# Altium project CMD3_KIT.PrjPcb
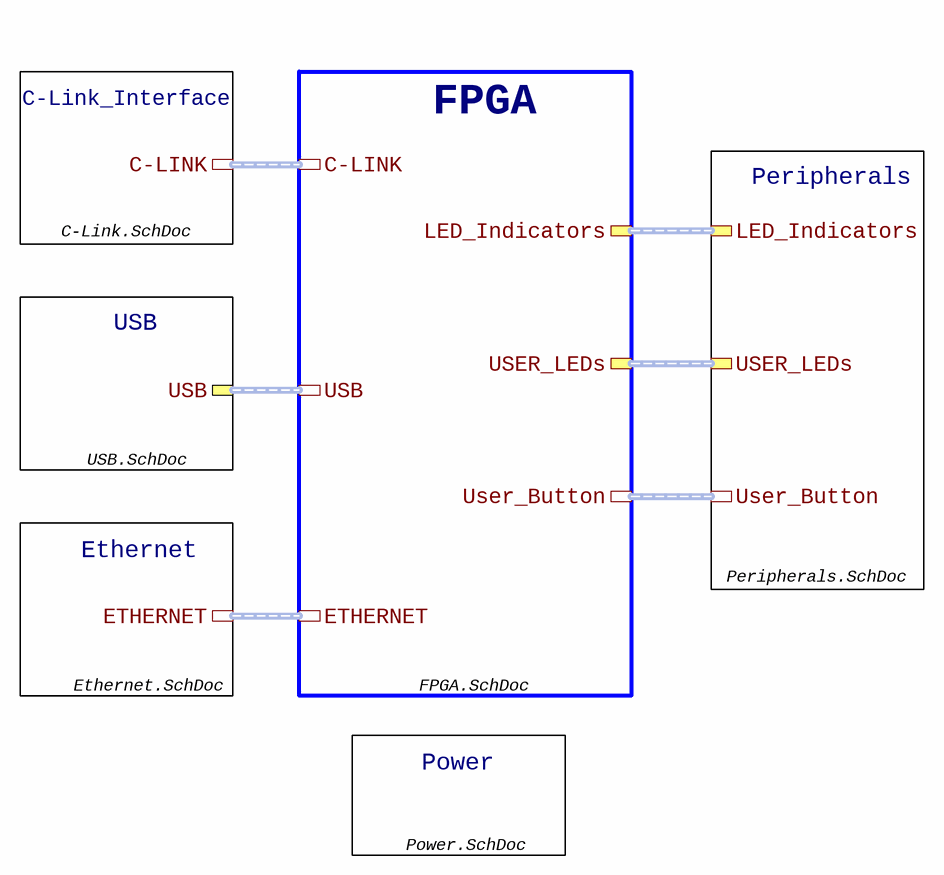
[diagram p0: Top.SchDoc]
7 sheets, 210 parts. Net scope: hierarchical (ports join the sheet entries above them; power ports are global).
Board file: CMD3_KIT.PcbDoc
Sheets:
  Top.SchDoc
    C-Link_Interface = C-Link.SchDoc
    FPGA = FPGA.SchDoc
    Ethernet = Ethernet.SchDoc
    USB = USB.SchDoc
    Power = Power.SchDoc
    Peripherals = Peripherals.SchDoc

## Sheet Top.SchDoc
size A4; Author: ALTIUM GOSTBOM2.0 KEV; SheetNumber: 1; SheetTotal: 7

### Sub-sheets
C-Link_Interface = C-Link.SchDoc: C-LINK (harness C-LINK)
Ethernet = Ethernet.SchDoc: ETHERNET (harness MII Signal Descriptions)
FPGA = FPGA.SchDoc: C-LINK (harness C-LINK), USB (harness USB), ETHERNET (harness MII Signal Descriptions), LED_Indicators (harness Indicators), USER_LEDs (harness USER_LEDs), User_Button (harness User_Button)
Peripherals = Peripherals.SchDoc: USER_LEDs (harness USER_LEDs), LED_Indicators (harness Indicators), User_Button (harness User_Button)  | NameFunctionGroup: Функциональная группа
Power = Power.SchDoc: no entries
USB = USB.SchDoc: USB (harness USB)

### Buses and harness runs
harness sheet C-Link_Interface/C-LINK = sheet FPGA/C-LINK
harness sheet Ethernet/ETHERNET = sheet FPGA/ETHERNET
harness sheet FPGA/LED_Indicators = sheet Peripherals/LED_Indicators
harness sheet FPGA/USB = sheet USB/USB
harness sheet FPGA/User_Button = sheet Peripherals/User_Button
harness sheet FPGA/USER_LEDs = sheet Peripherals/USER_LEDs

### Notes on the sheet
- Перв. примен.
- Справ. №
- Подп. дата
- Инв. № дубл.
- Взам. инв. №
- Подп. и дата
- Изм.
- Разраб.
- Лист
- № докум.
- Подп.
- Дата
- Лит.
- Масса
- Масштаб
- Пров.
- Т.контр.
- Листов
- Инв. № подл.
- Н.контр.
- Утв.
- ALTIUM GOSTBOM2.0 KEV
- Файл:
- Копировал
- Формат А3

## Sheet C-Link.SchDoc
size A4; Author: ALTIUM GOSTBOM2.0 KEV; SheetNumber: 3; SheetTotal: 7
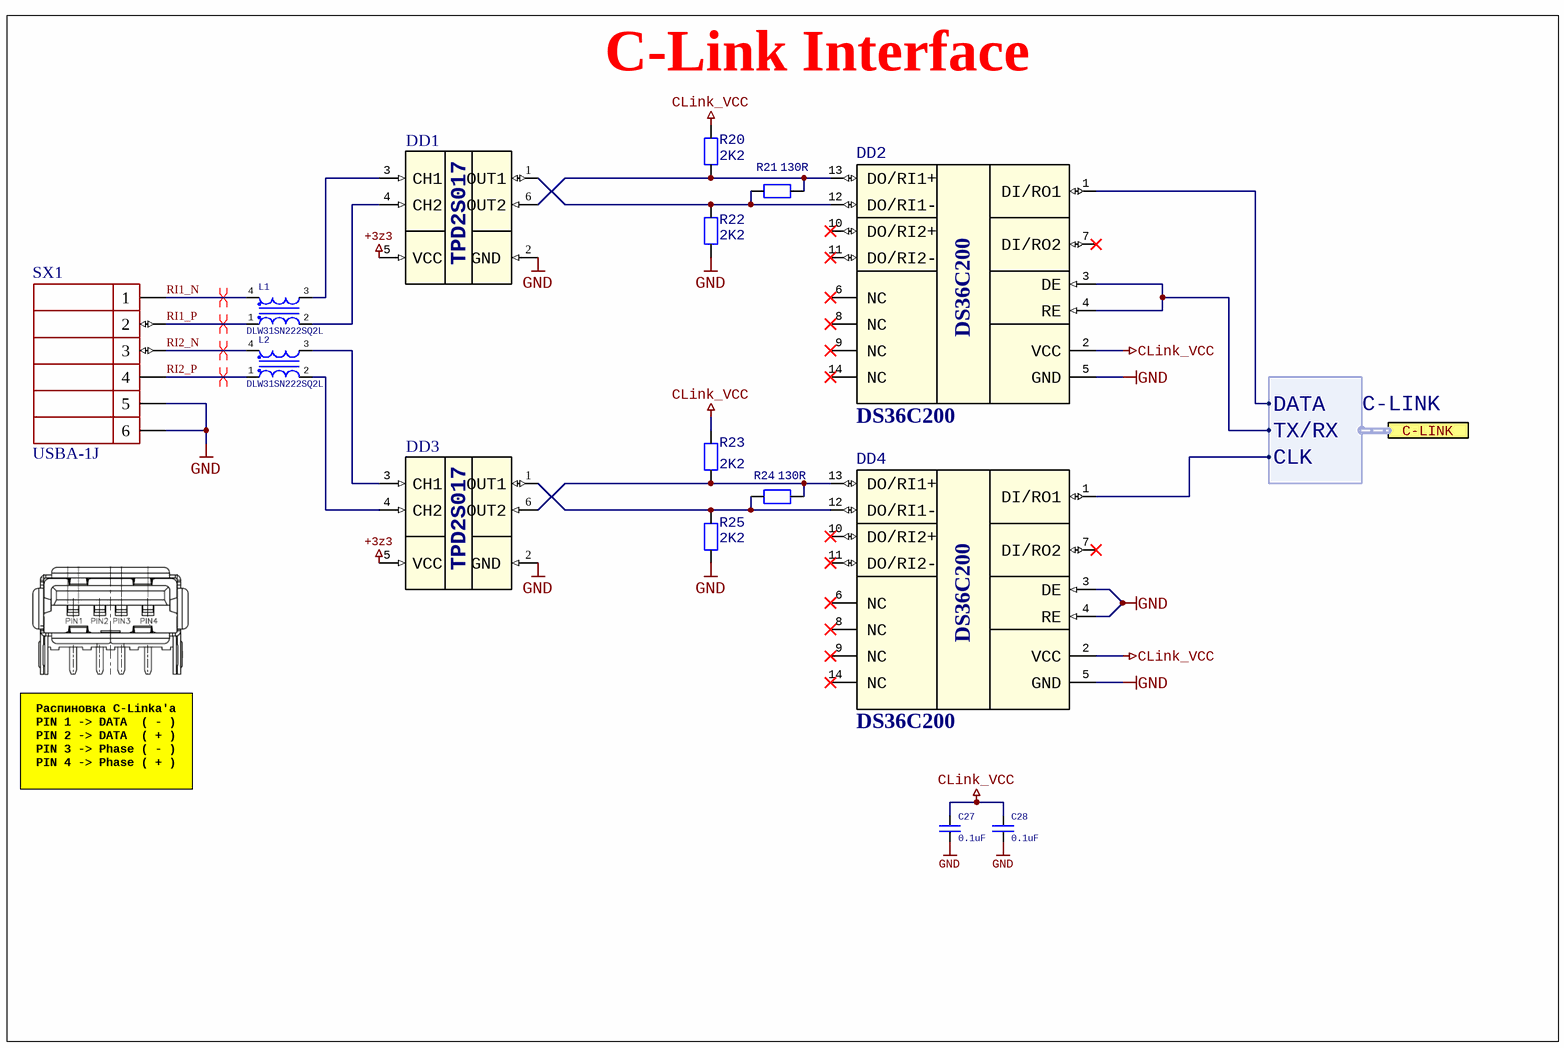
[diagram p1: C-Link.SchDoc]

### Parts
C27  0.1uF  [C_0603]
C28  0.1uF  [C_0603]
DD1  TPD2S017  [SOT-23-6]  (value not drawn)
DD2  DS36C200  [SOIC-14]
DD3  TPD2S017  [SOT-23-6]  (value not drawn)
DD4  DS36C200  [SOIC-14]
L1  DLW31SN222SQ2L  [Choke_Coil]
L2  DLW31SN222SQ2L  [Choke_Coil]
R20  2K2  [R_0603]
R21  130R  [R_0603]
R22  2K2  [R_0603]
R23  2K2  [R_0603]
R24  130R  [R_0603]
R25  2K2  [R_0603]
SX1  USBA-1J  [USB_A_(DS1095)]

### Ports
C-LINK (harness C-LINK)

### Harnesses
C-LINK: CLK, DATA, TX/RX

### Nets
+3z3: DD1.5(VCC) DD3.5(VCC)
CLink_VCC: C27.2 C28.2 DD2.2(VCC) DD4.2(VCC) R20.1 R23.1
GND: C27.1 C28.1 DD1.2(GND) DD2.5(GND) DD3.2(GND) DD4.3(DE) DD4.4(RE) DD4.5(GND) R22.2 R25.2 SX1.5 SX1.6
C_LINK_TX/RX: DD2.3(DE) DD2.4(RE) ; port C-LINK.TX/RX
RI1_N: L1.4 SX1.1
RI1_P: L1.1 SX1.2
RI2_N: L2.4 SX1.3
RI2_P: L2.1 SX1.4
NetDD1_1: DD1.1(OUT1) DD2.12(DO/RI1-) R21.1 R22.1
NetDD1_3: DD1.3(CH1) L1.3
NetDD1_4: DD1.4(CH2) L1.2
NetDD1_6: DD1.6(OUT2) DD2.13(DO/RI1+) R20.2 R21.2
NetDD2_1: DD2.1(DI/RO1) ; port C-LINK.DATA
NetDD3_1: DD3.1(OUT1) DD4.12(DO/RI1-) R24.1 R25.1
NetDD3_3: DD3.3(CH1) L2.3
NetDD3_4: DD3.4(CH2) L2.2
NetDD3_6: DD3.6(OUT2) DD4.13(DO/RI1+) R23.2 R24.2
NetDD4_1: DD4.1(DI/RO1) ; port C-LINK.CLK

Not connected (* = marked no-connect by the designer): DD2 6(NC)* 7(DI/RO2)* 8(NC)* 9(NC)* 10(DO/RI2+)* 11(DO/RI2-)* 14(NC)*; DD4 6(NC)* 7(DI/RO2)* 8(NC)* 9(NC)* 10(DO/RI2+)* 11(DO/RI2-)* 14(NC)*

### Layout directives
differential pair: RI1_N, RI1_P, RI2_N, RI2_P

### Notes on the sheet
- (near R20) С-Link Interface
- Распиновка С-Linka'a
  PIN 1 -> DATA  ( - )
  PIN 2 -> DATA  ( + )
  PIN 3 -> Phase ( - )
  PIN 4 -> Phase ( + )
- Перв. примен.
- Справ. №
- Подп. дата
- Инв. № дубл.
- Взам. инв. №
- Подп. и дата
- Изм.
- Разраб.
- Лист
- № докум.
- Подп.
- Дата
- Лит.
- Масса
- Масштаб
- Пров.
- Т.контр.
- Листов
- Инв. № подл.
- Н.контр.
- Утв.
- ALTIUM GOSTBOM2.0 KEV
- Файл:
- Копировал
- Формат А3

### Library data of the parts
C27 C28 = C: Non-polarised capacitor; ComponentLink1Description: Manufacturer Link; ComponentLink1URL: www.murata.com; ComponentLink2Description: Datasheet Link; ComponentLink2URL: http://www.murata.com/products/catalog/pdf/c02e.pdf; ValueSCH: *
L1 L2 = L_1
R20-R25 = R

## Sheet FPGA.SchDoc
size A2; Author: ALTIUM GOSTBOM2.0 KEV; SheetNumber: 2; SheetTotal: 7
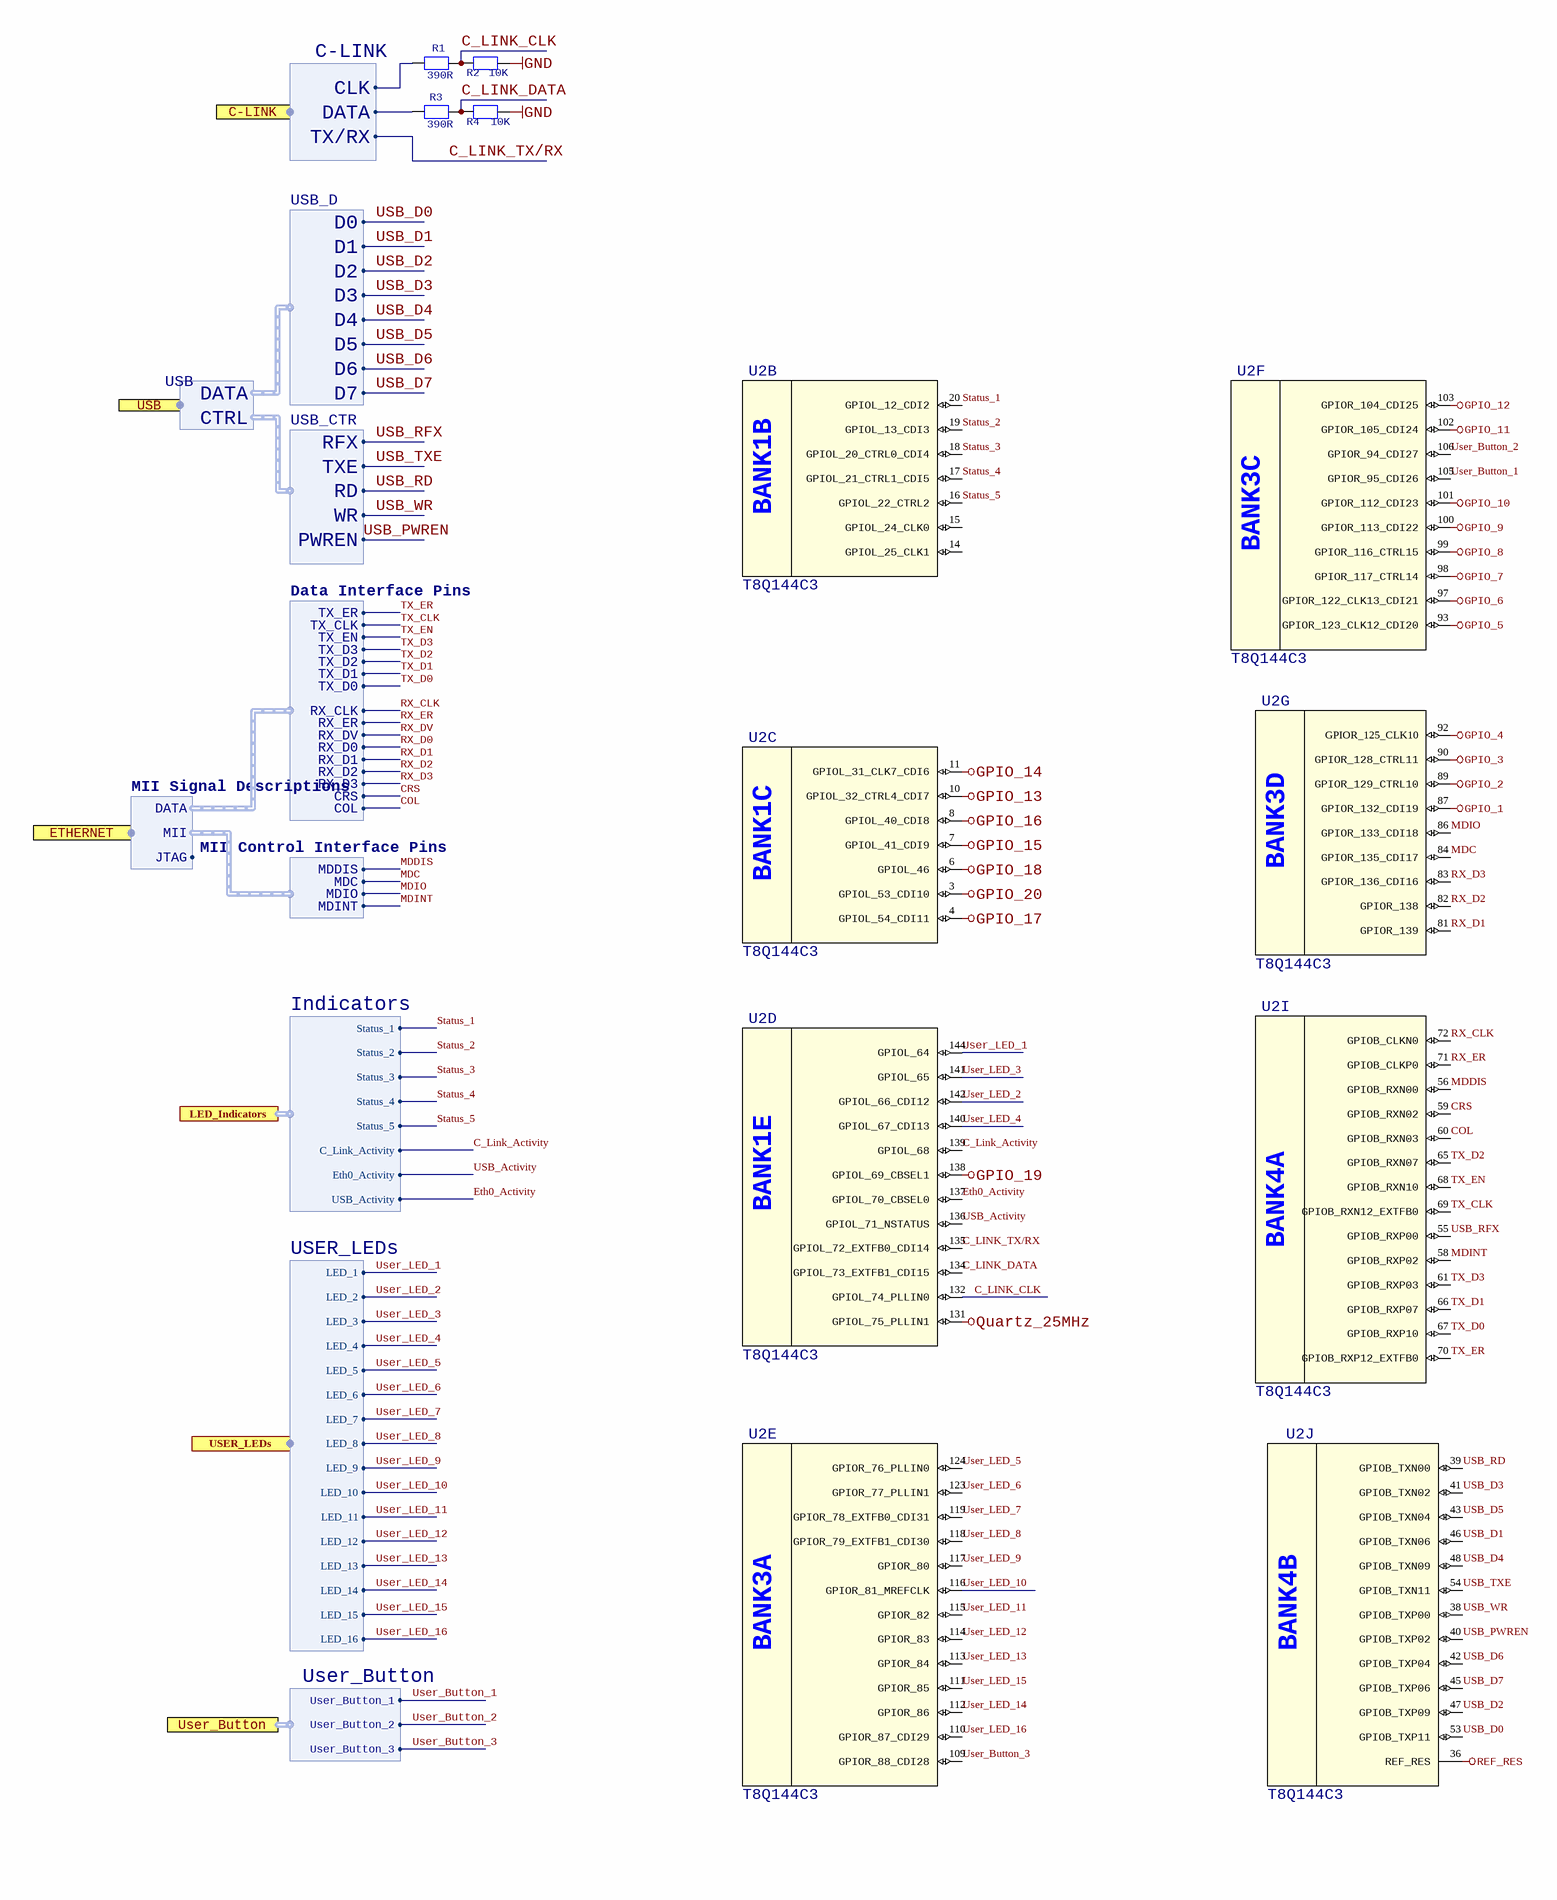
[diagram p2: FPGA.SchDoc, left]
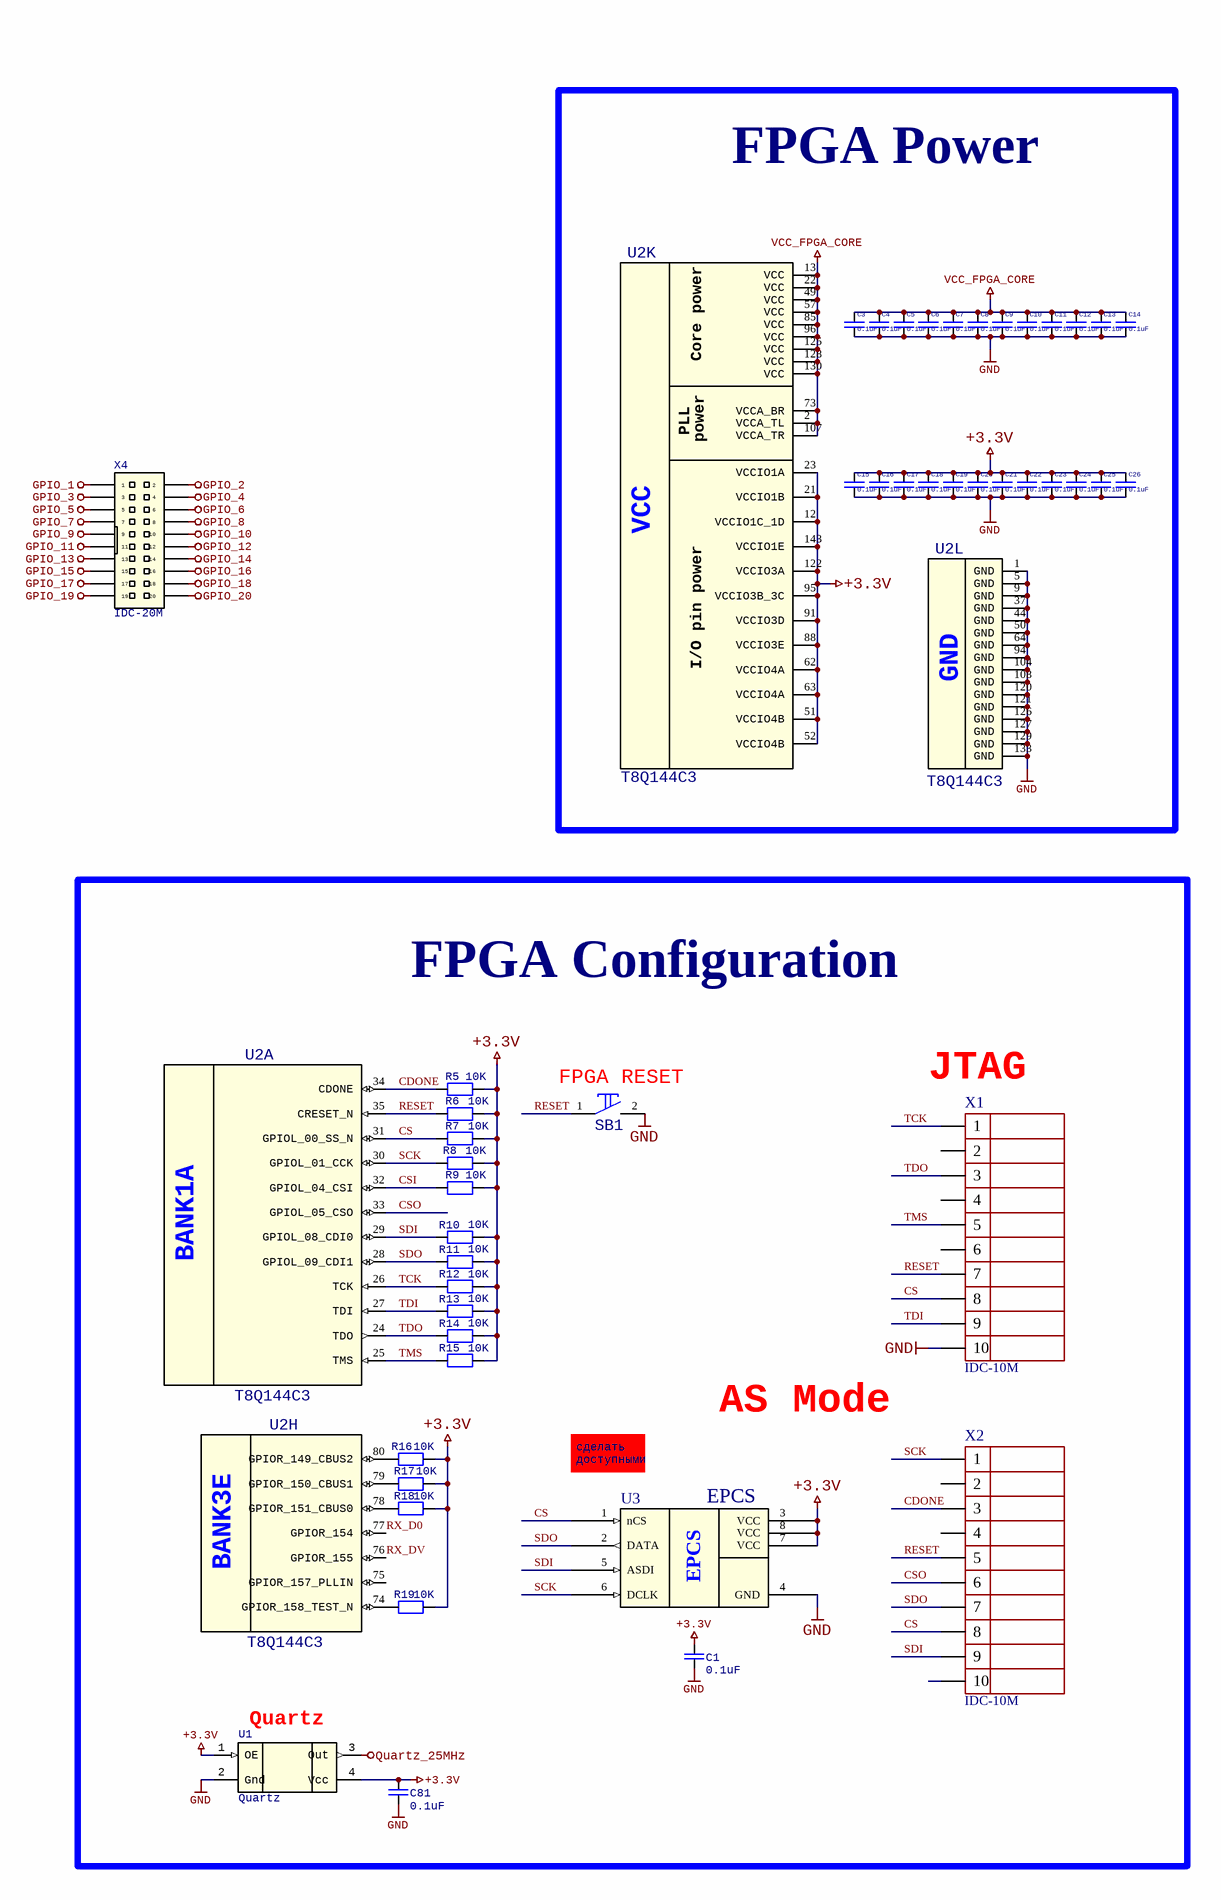
[diagram p3: FPGA.SchDoc, right]

### Parts
C1  0.1uF  [C_0603]
C3  0.1uF  [C_0603]
C4  0.1uF  [C_0603]
C5  0.1uF  [C_0603]
C6  0.1uF  [C_0603]
C7  0.1uF  [C_0603]
C8  0.1uF  [C_0603]
C9  0.1uF  [C_0603]
C10  0.1uF  [C_0603]
C11  0.1uF  [C_0603]
C12  0.1uF  [C_0603]
C13  0.1uF  [C_0603]
C14  0.1uF  [C_0603]
C15  0.1uF  [C_0603]
C16  0.1uF  [C_0603]
C17  0.1uF  [C_0603]
C18  0.1uF  [C_0603]
C19  0.1uF  [C_0603]
C20  0.1uF  [C_0603]
C21  0.1uF  [C_0603]
C22  0.1uF  [C_0603]
C23  0.1uF  [C_0603]
C24  0.1uF  [C_0603]
C25  0.1uF  [C_0603]
C26  0.1uF  [C_0603]
C81  0.1uF  [C_0603]
R1  390R  [R_0603]
R2  10K  [R_0603]
R3  390R  [R_0603]
R4  10K  [R_0603]
R5  10K  [R_0603]
R6  10K  [R_0603]
R7  10K  [R_0603]
R8  10K  [R_0603]
R9  10K  [R_0603]
R10  10K  [R_0603]
R11  10K  [R_0603]
R12  10K  [R_0603]
R13  10K  [R_0603]
R14  10K  [R_0603]
R15  10K  [R_0603]
R16  10K  [R_0603]
R17  10K  [R_0603]
R18  10K  [R_0603]
R19  10K  [R_0603]
SB1  Text  [DTS-32]  (value not drawn)
U1  Quartz  [SMD_Qz_7mmX5mm]
U2  T8Q144C3  [LQFP- 144]  (parts A,B,C,D,E,F,G,H,I,J,K,L of 12)
U3  EPCS  [SOIC8_N]
X1  IDC-10M  [IDC-10MS]
X2  IDC-10M  [IDC-10MS]
X4  IDC-20M  [IDC-20]

### Blocks framed on the sheet
FPGA Power: C3-C26 U2
FPGA Configuration: C1 C81 R5-R19 SB1 U1-U3 X1 X2

### Ports
C-LINK (harness C-LINK), ETHERNET (harness MII Signal Descriptions), LED_Indicators (harness Indicators), USB (harness USB), User_Button (harness User_Button), USER_LEDs (harness USER_LEDs)

### Harnesses
C-LINK: CLK, DATA, TX/RX
USB_D: D0, D1, D2, D3, D4, D5, D6, D7
USB_CTR: RFX, TXE, RD, WR, PWREN
USB: DATA, CTRL
MII Control Interface Pins: MDDIS, MDC, MDIO, MDINT
Data Interface Pins: TX_ER, TX_CLK, TX_EN, TX_D3, TX_D2, TX_D1, TX_D0, RX_CLK, RX_ER, RX_DV, RX_D0, RX_D1, RX_D2, RX_D3, CRS, COL
MII Signal Descriptions: MII, DATA, JTAG
USER_LEDs: LED_1, LED_2, LED_3, LED_4, LED_5, LED_6, LED_7, LED_8, LED_9, LED_10, LED_11, LED_12, LED_13, LED_14, LED_15, LED_16
User_Button: User_Button_1, User_Button_2, User_Button_3
Indicators: Eth0_Activity, USB_Activity, C_Link_Activity, Status_5, Status_4, Status_3, Status_2, Status_1

### Nets
+3.3V: C1.1 C15.1 C16.1 C17.1 C18.1 C19.1 C20.1 C21.1 C22.1 C23.1 C24.1 C25.1 C26.1 C81.2 R5.2 R6.2 R7.2 R8.2 R9.2 R10.2 R11.2 R12.2 R13.2 R14.2 R15.2 R16.2 R17.2 R18.2 R19.2 U1.1(OE) U1.4(Vcc) U2.12(VCCIO1C_1D) U2.21(VCCIO1B) U2.23(VCCIO1A) U2.51(VCCIO4B) U2.52(VCCIO4B) U2.62(VCCIO4A) U2.63(VCCIO4A) U2.88(VCCIO3E) U2.91(VCCIO3D) U2.95(VCCIO3B_3C) U2.122(VCCIO3A) U2.143(VCCIO1E) U3.3(VCC) U3.7(VCC) U3.8(VCC)
GND: C1.2 C3.2 C4.2 C5.2 C6.2 C7.2 C8.2 C9.2 C10.2 C11.2 C12.2 C13.2 C14.2 C15.2 C16.2 C17.2 C18.2 C19.2 C20.2 C21.2 C22.2 C23.2 C24.2 C25.2 C26.2 C81.1 R2.2 R4.2 SB1.2 U1.2(Gnd) U2.1(GND) U2.5(GND) U2.9(GND) U2.37(GND) U2.44(GND) U2.50(GND) U2.64(GND) U2.94(GND) U2.104(GND) U2.108(GND) U2.120(GND) U2.121(GND) U2.126(GND) U2.127(GND) U2.129(GND) U2.133(GND) U3.4(GND) X1.10
GPIO_1: U2.87(GPIOR_132_CDI19) X4.1
GPIO_2: U2.89(GPIOR_129_CTRL10) X4.2
GPIO_3: U2.90(GPIOR_128_CTRL11) X4.3
GPIO_4: U2.92(GPIOR_125_CLK10) X4.4
GPIO_5: U2.93(GPIOR_123_CLK12_CDI20) X4.5
GPIO_6: U2.97(GPIOR_122_CLK13_CDI21) X4.6
GPIO_7: U2.98(GPIOR_117_CTRL14) X4.7
GPIO_8: U2.99(GPIOR_116_CTRL15) X4.8
GPIO_9: U2.100(GPIOR_113_CDI22) X4.9
GPIO_10: U2.101(GPIOR_112_CDI23) X4.10
GPIO_11: U2.102(GPIOR_105_CDI24) X4.11
GPIO_12: U2.103(GPIOR_104_CDI25) X4.12
GPIO_13: U2.10(GPIOL_32_CTRL4_CDI7) X4.13
GPIO_14: U2.11(GPIOL_31_CLK7_CDI6) X4.14
GPIO_15: U2.7(GPIOL_41_CDI9) X4.15
GPIO_16: U2.8(GPIOL_40_CDI8) X4.16
GPIO_17: U2.4(GPIOL_54_CDI11) X4.17
GPIO_18: U2.6(GPIOL_46) X4.18
GPIO_19: U2.138(GPIOL_69_CBSEL1) X4.19
GPIO_20: U2.3(GPIOL_53_CDI10) X4.20
Quartz_25MHz: U1.3(Out) U2.131(GPIOL_75_PLLIN1)
REF_RES: U2.36(REF_RES)
VCC_FPGA_CORE: C3.1 C4.1 C5.1 C6.1 C7.1 C8.1 C9.1 C10.1 C11.1 C12.1 C13.1 C14.1 U2.2(VCCA_TL) U2.13(VCC) U2.22(VCC) U2.49(VCC) U2.57(VCC) U2.73(VCCA_BR) U2.85(VCC) U2.96(VCC) U2.107(VCCA_TR) U2.125(VCC) U2.128(VCC) U2.130(VCC)
C_Link_Activity: U2.139(GPIOL_68) ; port LED_Indicators.C_Link_Activity
C_LINK_CLK: R1.2 R2.1 U2.132(GPIOL_74_PLLIN0)
C_LINK_DATA: R3.2 R4.1 U2.134(GPIOL_73_EXTFB1_CDI15)
C_LINK_TX/RX: U2.135(GPIOL_72_EXTFB0_CDI14) ; port C-LINK.TX/RX
CDONE: R5.1 U2.34(CDONE) X2.3
COL: U2.60(GPIOB_RXN03) ; harness Data Interface Pins.COL
CRS: U2.59(GPIOB_RXN02) ; harness Data Interface Pins.CRS
CS: R7.1 U2.31(GPIOL_00_SS_N) U3.1(nCS) X1.8 X2.8
CSI: R9.1 U2.32(GPIOL_04_CSI)
CSO: U2.33(GPIOL_05_CSO) X2.6
Eth0_Activity: U2.137(GPIOL_70_CBSEL0) ; port LED_Indicators.USB_Activity
MDC: U2.84(GPIOR_135_CDI17) ; harness MII Control Interface Pins.MDC
MDDIS: U2.56(GPIOB_RXN00) ; harness MII Control Interface Pins.MDDIS
MDINT: U2.58(GPIOB_RXP02) ; harness MII Control Interface Pins.MDINT
MDIO: U2.86(GPIOR_133_CDI18) ; harness MII Control Interface Pins.MDIO
RESET: R6.1 SB1.1 U2.35(CRESET_N) X1.7 X2.5
RX_CLK: U2.72(GPIOB_CLKN0) ; harness Data Interface Pins.RX_CLK
RX_D0: U2.77(GPIOR_154) ; harness Data Interface Pins.RX_D0
RX_D1: U2.81(GPIOR_139) ; harness Data Interface Pins.RX_D1
RX_D2: U2.82(GPIOR_138) ; harness Data Interface Pins.RX_D2
RX_D3: U2.83(GPIOR_136_CDI16) ; harness Data Interface Pins.RX_D3
RX_DV: U2.76(GPIOR_155) ; harness Data Interface Pins.RX_DV
RX_ER: U2.71(GPIOB_CLKP0) ; harness Data Interface Pins.RX_ER
SCK: R8.1 U2.30(GPIOL_01_CCK) U3.6(DCLK) X2.1
SDI: R10.1 U2.29(GPIOL_08_CDI0) U3.5(ASDI) X2.9
SDO: R11.1 U2.28(GPIOL_09_CDI1) U3.2(DATA) X2.7
Status_1: U2.20(GPIOL_12_CDI2) ; port LED_Indicators.Status_1
Status_2: U2.19(GPIOL_13_CDI3) ; port LED_Indicators.Status_2
Status_3: U2.18(GPIOL_20_CTRL0_CDI4) ; port LED_Indicators.Status_3
Status_4: U2.17(GPIOL_21_CTRL1_CDI5) ; port LED_Indicators.Status_4
Status_5: U2.16(GPIOL_22_CTRL2) ; port LED_Indicators.Status_5
TCK: R12.1 U2.26(TCK) X1.1
TDI: R13.1 U2.27(TDI) X1.9
TDO: R14.1 U2.24(TDO) X1.3
TMS: R15.1 U2.25(TMS) X1.5
TX_CLK: U2.69(GPIOB_RXN12_EXTFB0) ; harness Data Interface Pins.TX_CLK
TX_D0: U2.67(GPIOB_RXP10) ; harness Data Interface Pins.TX_D0
TX_D1: U2.66(GPIOB_RXP07) ; harness Data Interface Pins.TX_D1
TX_D2: U2.65(GPIOB_RXN07) ; harness Data Interface Pins.TX_D2
TX_D3: U2.61(GPIOB_RXP03) ; harness Data Interface Pins.TX_D3
TX_EN: U2.68(GPIOB_RXN10) ; harness Data Interface Pins.TX_EN
TX_ER: U2.70(GPIOB_RXP12_EXTFB0) ; harness Data Interface Pins.TX_ER
USB_Activity: U2.136(GPIOL_71_NSTATUS) ; port LED_Indicators.Eth0_Activity
USB_D0: U2.53(GPIOB_TXP11) ; harness USB_D.D0
USB_D1: U2.46(GPIOB_TXN06) ; harness USB_D.D1
USB_D2: U2.47(GPIOB_TXP09) ; harness USB_D.D2
USB_D3: U2.41(GPIOB_TXN02) ; harness USB_D.D3
USB_D4: U2.48(GPIOB_TXN09) ; harness USB_D.D4
USB_D5: U2.43(GPIOB_TXN04) ; harness USB_D.D5
USB_D6: U2.42(GPIOB_TXP04) ; harness USB_D.D6
USB_D7: U2.45(GPIOB_TXP06) ; harness USB_D.D7
USB_PWREN: U2.40(GPIOB_TXP02) ; harness USB_CTR.PWREN
USB_RD: U2.39(GPIOB_TXN00) ; harness USB_CTR.RD
USB_RFX: U2.55(GPIOB_RXP00) ; harness USB_CTR.RFX
USB_TXE: U2.54(GPIOB_TXN11) ; harness USB_CTR.TXE
USB_WR: U2.38(GPIOB_TXP00) ; harness USB_CTR.WR
User_Button_1: U2.105(GPIOR_95_CDI26) ; port User_Button.User_Button_1
User_Button_2: U2.106(GPIOR_94_CDI27) ; port User_Button.User_Button_2
User_Button_3: U2.109(GPIOR_88_CDI28) ; port User_Button.User_Button_3
User_LED_1: U2.144(GPIOL_64) ; port USER_LEDs.LED_1
User_LED_2: U2.142(GPIOL_66_CDI12) ; port USER_LEDs.LED_2
User_LED_3: U2.141(GPIOL_65) ; port USER_LEDs.LED_3
User_LED_4: U2.140(GPIOL_67_CDI13) ; port USER_LEDs.LED_4
User_LED_5: U2.124(GPIOR_76_PLLIN0) ; port USER_LEDs.LED_5
User_LED_6: U2.123(GPIOR_77_PLLIN1) ; port USER_LEDs.LED_6
User_LED_7: U2.119(GPIOR_78_EXTFB0_CDI31) ; port USER_LEDs.LED_7
User_LED_8: U2.118(GPIOR_79_EXTFB1_CDI30) ; port USER_LEDs.LED_8
User_LED_9: U2.117(GPIOR_80) ; port USER_LEDs.LED_9
User_LED_10: U2.116(GPIOR_81_MREFCLK) ; port USER_LEDs.LED_10
User_LED_11: U2.115(GPIOR_82) ; port USER_LEDs.LED_11
User_LED_12: U2.114(GPIOR_83) ; port USER_LEDs.LED_12
User_LED_13: U2.113(GPIOR_84) ; port USER_LEDs.LED_13
User_LED_14: U2.112(GPIOR_86) ; port USER_LEDs.LED_14
User_LED_15: U2.111(GPIOR_85) ; port USER_LEDs.LED_15
User_LED_16: U2.110(GPIOR_87_CDI29) ; port USER_LEDs.LED_16
NetDD2_1: R3.1 ; port C-LINK.DATA
NetDD4_1: R1.1 ; port C-LINK.CLK
NetR16_1: R16.1 U2.80(GPIOR_149_CBUS2)
NetR17_1: R17.1 U2.79(GPIOR_150_CBUS1)
NetR18_1: R18.1 U2.78(GPIOR_151_CBUS0)
NetR19_1: R19.1 U2.74(GPIOR_158_TEST_N)

Not connected (* = marked no-connect by the designer): U2 14(GPIOL_25_CLK1) 15(GPIOL_24_CLK0) 75(GPIOR_157_PLLIN); X1 2 4 6; X2 2 4 10

### Notes on the sheet
- (near SB1) FPGA RESET
- (near X1) JTAG
- AS Mode
- (near U3) сделать доступными для резки
- (near U1) Quartz
- Перв. примен.
- Справ. №
- Подп. дата
- Инв. № дубл.
- Взам. инв. №
- Подп. и дата
- Изм.
- Разраб.
- Лист
- № докум.
- Подп.
- Дата
- Лит.
- Масса
- Масштаб
- Пров.
- Т.контр.
- Листов
- Инв. № подл.
- Н.контр.
- Утв.
- ALTIUM GOSTBOM2.0 KEV
- Файл:
- Копировал
- Формат А3
- (in symbol Trion_T8Q144 FPGA, part A) BANK1A
- (in symbol Trion_T8Q144 FPGA, part B) BANK1B
- (in symbol Trion_T8Q144 FPGA, part C) BANK1C
- (in symbol Trion_T8Q144 FPGA, part D) BANK1E
- (in symbol Trion_T8Q144 FPGA, part E) BANK3A
- (in symbol Trion_T8Q144 FPGA, part F) BANK3C
- (in symbol Trion_T8Q144 FPGA, part G) BANK3D
- (in symbol Trion_T8Q144 FPGA, part H) BANK3E
- (in symbol Trion_T8Q144 FPGA, part I) BANK4A
- (in symbol Trion_T8Q144 FPGA, part J) BANK4B
- (in symbol Trion_T8Q144 FPGA, part K) Core power; PLL; power; I/O pin power

### Library data of the parts
C1 C3-C26 C81 = C: Non-polarised capacitor; ComponentLink1Description: Manufacturer Link; ComponentLink1URL: www.murata.com; ComponentLink2Description: Datasheet Link; ComponentLink2URL: http://www.murata.com/products/catalog/pdf/c02e.pdf; ValueSCH: *
R1-R19 = R
SB1 = Button: Published: 17.04.2014; Publisher: Andrew Danich; Type: Переключатель
U1 = Quartz: Crystal Oscillator (SMD)
U2 = Trion_T8Q144 FPGA: Trion T8 FPGA
U3 = EPCS: Serial Configuration (EPCS) Devices

## Sheet Ethernet.SchDoc
size A4; Author: ALTIUM GOSTBOM2.0 KEV; SheetNumber: 6; SheetTotal: 7
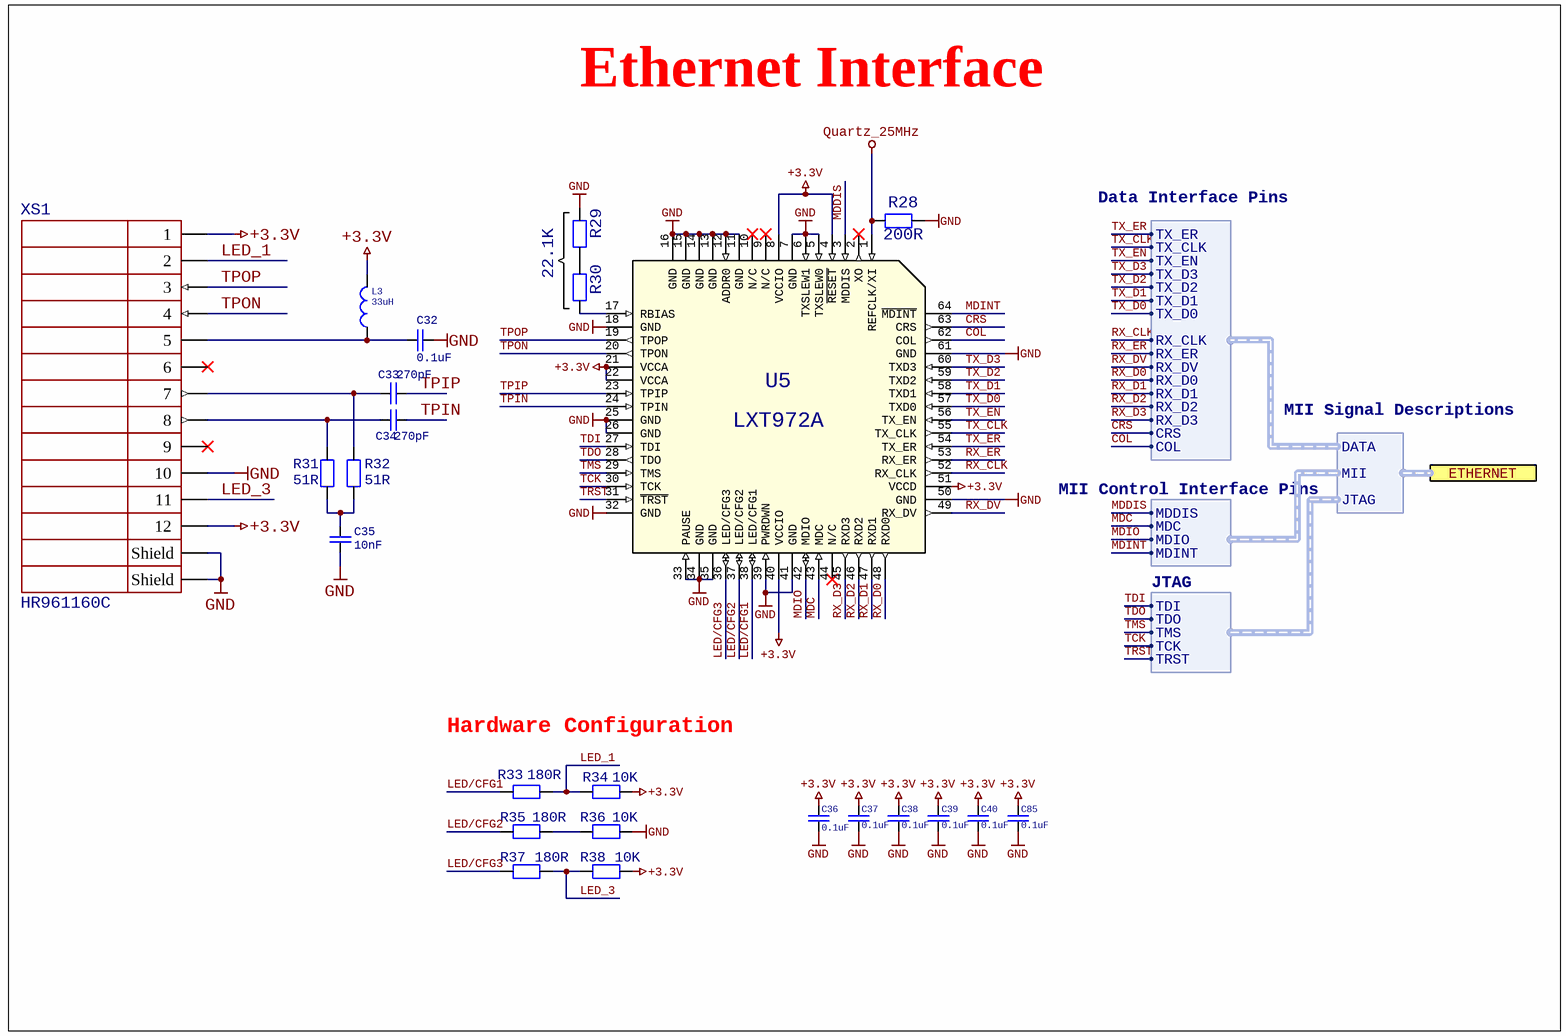
[diagram p4: Ethernet.SchDoc]

### Parts
C32  0.1uF  [C_0603]
C33  270pF  [C_0603]
C34  270pF  [C_0603]
C35  10nF  [C_0603]
C36  0.1uF  [C_0603]
C37  0.1uF  [C_0603]
C38  0.1uF  [C_0603]
C39  0.1uF  [C_0603]
C40  0.1uF  [C_0603]
C85  0.1uF  [C_0603]
L3  33uH  [L_1206]
R28  200R  [R_0603]
R29  ?  [R_0603]  (value not drawn)
R30  22.1K  [R_0603]
R31  51R  [R_0603]
R32  51R  [R_0603]
R33  180R  [R_0603]
R34  10K  [R_0603]
R35  180R  [R_0603]
R36  10K  [R_0603]
R37  180R  [R_0603]
R38  10K  [R_0603]
U5  LXT972A  [LQFP-64]
XS1  HR961160C  [HR961160C]

### Ports
ETHERNET (harness MII Signal Descriptions)

### Harnesses
MII Control Interface Pins: MDDIS, MDC, MDIO, MDINT
Data Interface Pins: TX_ER, TX_CLK, TX_EN, TX_D3, TX_D2, TX_D1, TX_D0, RX_CLK, RX_ER, RX_DV, RX_D0, RX_D1, RX_D2, RX_D3, CRS, COL
JTAG: TDI, TDO, TMS, TCK, TRST
MII Signal Descriptions: MII, DATA, JTAG

### Nets
+3.3V: C36.1 C37.1 C38.1 C39.1 C40.1 C85.1 L3.2 R34.2 R38.2 U5.4(~{RESET}) U5.8(VCCIO) U5.21(VCCA) U5.22(VCCA) U5.40(VCCIO) U5.51(VCCD) XS1.1 XS1.12
GND: C32.2 C35.2 C36.2 C37.2 C38.2 C39.2 C40.2 C85.2 R28.2 R29.2 R36.2 U5.5(TXSLEW0) U5.6(TXSLEW1) U5.7(GND) U5.11(GND) U5.12(ADDR0) U5.13(GND) U5.14(GND) U5.15(GND) U5.16(GND) U5.18(GND) U5.25(GND) U5.26(GND) U5.32(GND) U5.33(PAUSE) U5.34(GND) U5.35(GND) U5.39(PWRDWN) U5.41(GND) U5.50(GND) U5.61(GND) XS1.10 XS1.Shield
Quartz_25MHz: R28.1 U5.1(REFCLK/XI)
COL: U5.62(COL) ; harness Data Interface Pins.COL
CRS: U5.63(CRS) ; harness Data Interface Pins.CRS
LED/CFG1: R33.1 U5.38(LED/CFG1)
LED/CFG2: R35.1 U5.37(LED/CFG2)
LED/CFG3: R37.1 U5.36(LED/CFG3)
LED_1: R33.2 R34.1 XS1.2
LED_3: R37.2 R38.1 XS1.11
MDC: U5.43(MDC) ; harness MII Control Interface Pins.MDC
MDDIS: U5.3(MDDIS) ; harness MII Control Interface Pins.MDDIS
MDINT: U5.64(~{MDINT}) ; harness MII Control Interface Pins.MDINT
MDIO: U5.42(MDIO) ; harness MII Control Interface Pins.MDIO
RX_CLK: U5.52(RX_CLK) ; harness Data Interface Pins.RX_CLK
RX_D0: U5.48(RXD0) ; harness Data Interface Pins.RX_D0
RX_D1: U5.47(RXD1) ; harness Data Interface Pins.RX_D1
RX_D2: U5.46(RXD2) ; harness Data Interface Pins.RX_D2
RX_D3: U5.45(RXD3) ; harness Data Interface Pins.RX_D3
RX_DV: U5.49(RX_DV) ; harness Data Interface Pins.RX_DV
RX_ER: U5.53(RX_ER) ; harness Data Interface Pins.RX_ER
TCK: U5.30(TCK) ; harness JTAG.TCK
TDI: U5.27(TDI) ; harness JTAG.TDI
TDO: U5.28(TDO) ; harness JTAG.TDO
TMS: U5.29(TMS) ; harness JTAG.TMS
TPIN: C34.2 U5.24(TPIN)
TPIP: C33.2 U5.23(TPIP)
TPON: U5.20(TPON) XS1.4
TPOP: U5.19(TPOP) XS1.3
TRST: U5.31(~{TRST}) ; harness JTAG.TRST
TX_CLK: U5.55(TX_CLK) ; harness Data Interface Pins.TX_CLK
TX_D0: U5.57(TXD0) ; harness Data Interface Pins.TX_D0
TX_D1: U5.58(TXD1) ; harness Data Interface Pins.TX_D1
TX_D2: U5.59(TXD2) ; harness Data Interface Pins.TX_D2
TX_D3: U5.60(TXD3) ; harness Data Interface Pins.TX_D3
TX_EN: U5.56(TX_EN) ; harness Data Interface Pins.TX_EN
TX_ER: U5.54(TX_ER) ; harness Data Interface Pins.TX_ER
NetC32_1: C32.1 L3.1 XS1.5
NetC33_1: C33.1 R32.1 XS1.7
NetC34_1: C34.1 R31.1 XS1.8
NetC35_1: C35.1 R31.2 R32.2
NetR29_1: R29.1 R30.1
NetR30_2: R30.2 U5.17(RBIAS)
NetR35_2: R35.2 R36.1

Not connected (* = marked no-connect by the designer): U5 2(XO)* 9(N/C)* 10(N/C)* 44(N/C)*; XS1 6* 9*

### Notes on the sheet
- Ethernet Interface
- Hardware Configuration
- Перв. примен.
- Справ. №
- Подп. дата
- Инв. № дубл.
- Взам. инв. №
- Подп. и дата
- Изм.
- Разраб.
- Лист
- № докум.
- Подп.
- Дата
- Лит.
- Масса
- Масштаб
- Пров.
- Т.контр.
- Листов
- Инв. № подл.
- Н.контр.
- Утв.
- ALTIUM GOSTBOM2.0 KEV
- Файл:
- Копировал
- Формат А3

### Library data of the parts
C32-C40 C85 = C: Non-polarised capacitor; ComponentLink1Description: Manufacturer Link; ComponentLink1URL: www.murata.com; ComponentLink2Description: Datasheet Link; ComponentLink2URL: http://www.murata.com/products/catalog/pdf/c02e.pdf; ValueSCH: *
L3 = L_2
R28-R38 = R
U5 = LXT972A: 10/100 Ethernet Transceiver

## Sheet USB.SchDoc
size A4; Author: ALTIUM GOSTBOM2.0 KEV; SheetNumber: 4; SheetTotal: 7
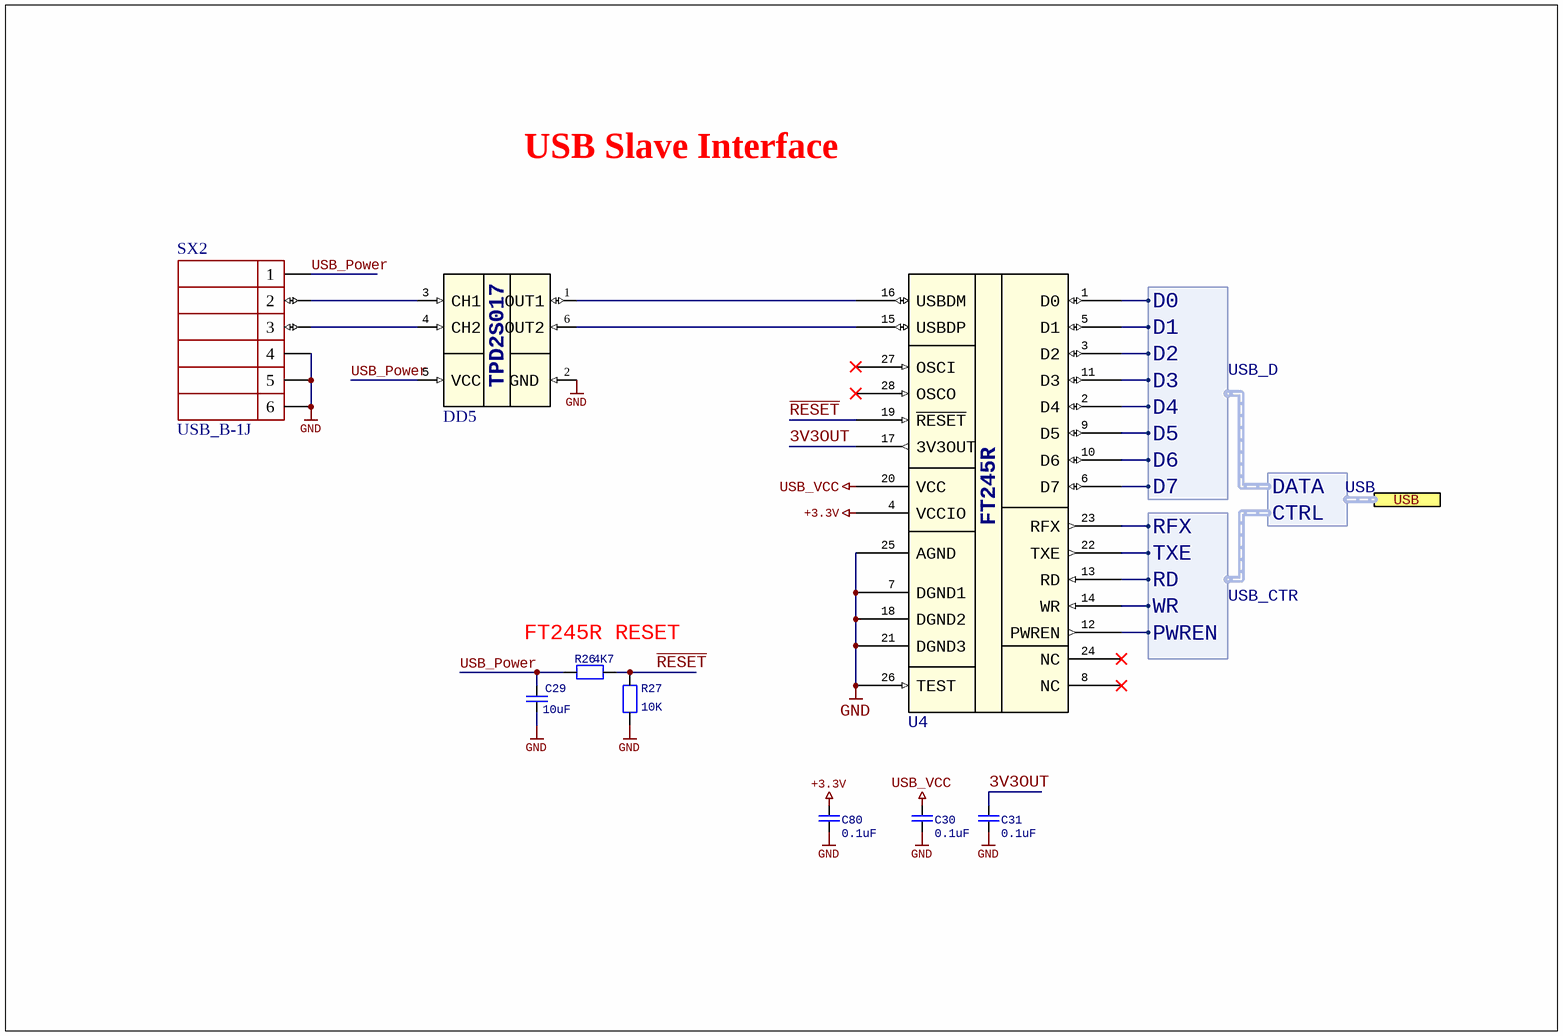
[diagram p5: USB.SchDoc]

### Parts
C29  10uF  [C_0603]
C30  0.1uF  [C_0603]
C31  0.1uF  [C_0603]
C80  0.1uF  [C_0603]
DD5  TPD2S017  [SOT-23-6]  (value not drawn)
R26  4K7  [R_0603]
R27  10K  [R_0603]
SX2  USB_B-1J  [USB_B_(DS1099)]
U4  FT245R  [SSOP- 28]  (value not drawn)

### Ports
USB (harness USB)

### Harnesses
USB_D: D0, D1, D2, D3, D4, D5, D6, D7
USB_CTR: RFX, TXE, RD, WR, PWREN
USB: DATA, CTRL

### Nets
+3.3V: C80.1 U4.4(VCCIO)
GND: C29.1 C30.2 C31.2 C80.2 DD5.2(GND) R27.2 SX2.4 SX2.5 SX2.6 U4.7(DGND1) U4.18(DGND2) U4.21(DGND3) U4.25(AGND) U4.26(TEST)
USB_VCC: C30.1 U4.20(VCC)
3V3OUT: C31.1 U4.17(3V3OUT)
~{RESET}: R26.2 R27.1 U4.19(~{RESET})
USB_D0: U4.1(D0) ; harness USB_D.D0
USB_D1: U4.5(D1) ; harness USB_D.D1
USB_D2: U4.3(D2) ; harness USB_D.D2
USB_D3: U4.11(D3) ; harness USB_D.D3
USB_D4: U4.2(D4) ; harness USB_D.D4
USB_D5: U4.9(D5) ; harness USB_D.D5
USB_D6: U4.10(D6) ; harness USB_D.D6
USB_D7: U4.6(D7) ; harness USB_D.D7
USB_Power: C29.2 DD5.5(VCC) R26.1 SX2.1
USB_PWREN: U4.12(PWREN) ; harness USB_CTR.PWREN
USB_RD: U4.13(RD) ; harness USB_CTR.RD
USB_RFX: U4.23(RFX) ; harness USB_CTR.RFX
USB_TXE: U4.22(TXE) ; harness USB_CTR.TXE
USB_WR: U4.14(WR) ; harness USB_CTR.WR
NetDD5_1: DD5.1(OUT1) U4.16(USBDM)
NetDD5_3: DD5.3(CH1) SX2.2
NetDD5_4: DD5.4(CH2) SX2.3
NetDD5_6: DD5.6(OUT2) U4.15(USBDP)

Not connected (* = marked no-connect by the designer): U4 8(NC)* 24(NC)* 27(OSCI)* 28(OSCO)*

### Notes on the sheet
- USB Slave Interface
- FT245R RESET
- Перв. примен.
- Справ. №
- Подп. дата
- Инв. № дубл.
- Взам. инв. №
- Подп. и дата
- Изм.
- Разраб.
- Лист
- № докум.
- Подп.
- Дата
- Лит.
- Масса
- Масштаб
- Пров.
- Т.контр.
- Листов
- Инв. № подл.
- Н.контр.
- Утв.
- ALTIUM GOSTBOM2.0 KEV
- Файл:
- Копировал
- Формат А3

### Library data of the parts
C29-C31 C80 = C: Non-polarised capacitor; ComponentLink1Description: Manufacturer Link; ComponentLink1URL: www.murata.com; ComponentLink2Description: Datasheet Link; ComponentLink2URL: http://www.murata.com/products/catalog/pdf/c02e.pdf; ValueSCH: *
R26 R27 = R
SX2 = USBA-1J

## Sheet Power.SchDoc
size A4; Author: ALTIUM GOSTBOM2.0 KEV; SheetNumber: 5; SheetTotal: 7
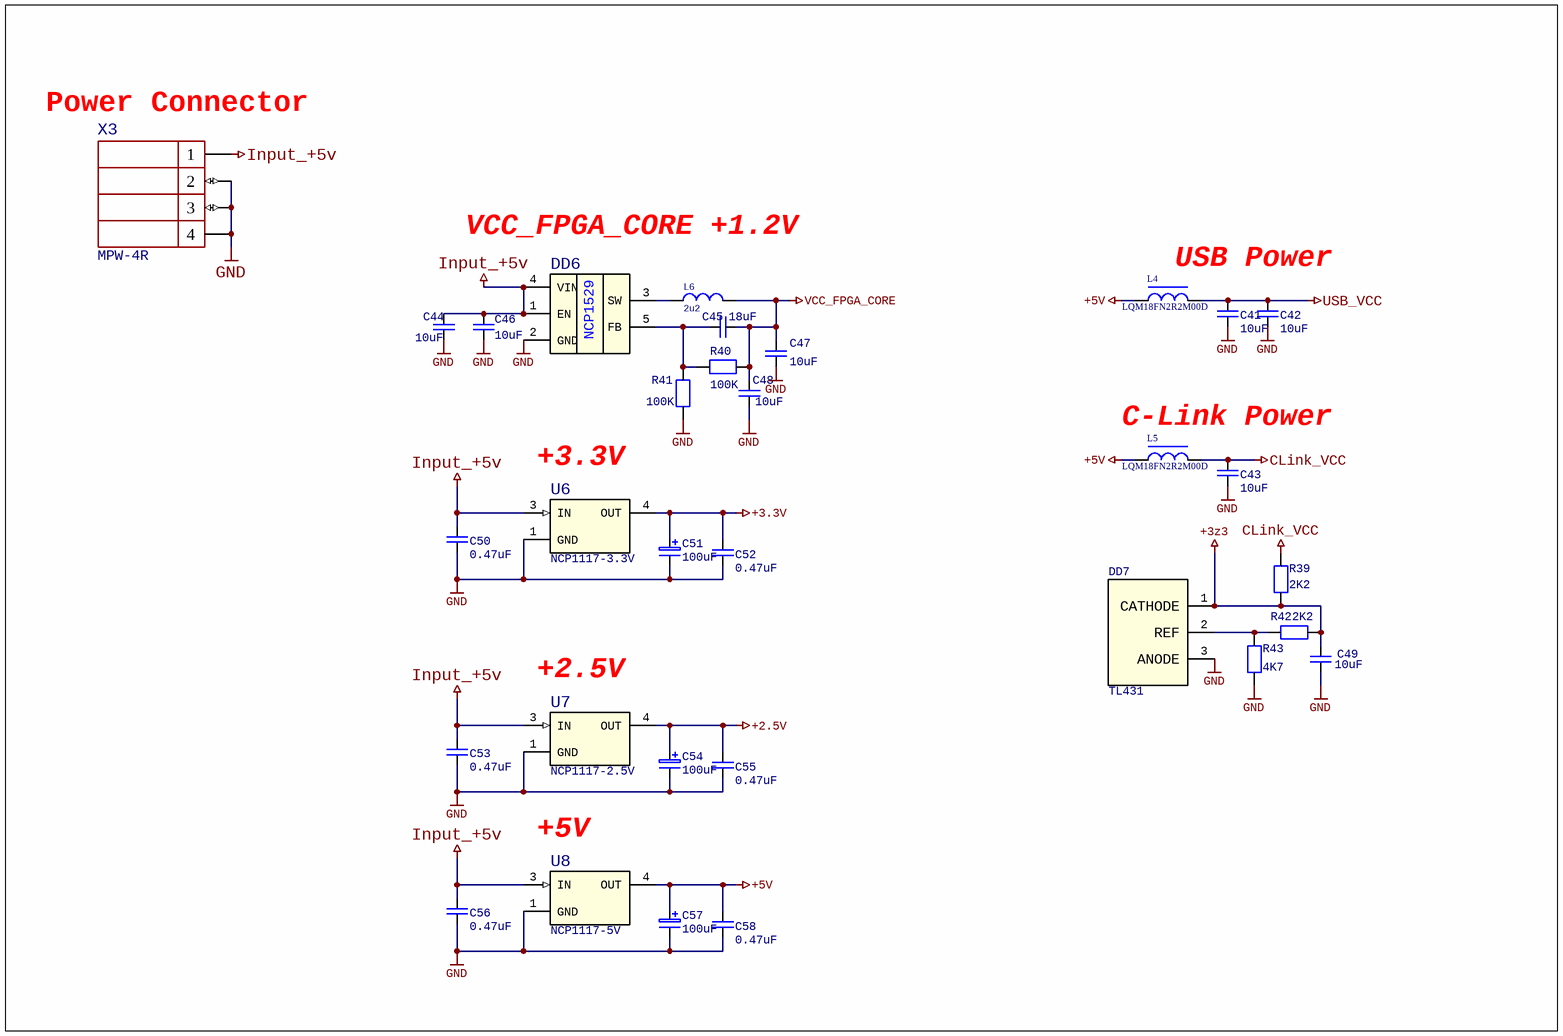
[diagram p6: Power.SchDoc]

### Parts
C41  10uF  [C_0603]
C42  10uF  [C_0603]
C43  10uF  [C_0603]
C44  10uF  [C_0603]
C45  18uF  [C_0603]
C46  10uF  [C_0603]
C47  10uF  [C_0603]
C48  10uF  [C_0603]
C49  10uF  [C_0603]
C50  0.47uF  [C_0603]
C51  100uF  [SMD D]
C52  0.47uF  [C_0603]
C53  0.47uF  [C_0603]
C54  100uF  [SMD D]
C55  0.47uF  [C_0603]
C56  0.47uF  [C_0603]
C57  100uF  [SMD D]
C58  0.47uF  [C_0603]
DD6  NCP1529  [SOT-23-5]  (value not drawn)
DD7  TL431  [SOT-23]
L4  LQM18FN2R2M00D  [L_0603]
L5  LQM18FN2R2M00D  [L_0603]
L6  2u2  [L_1008]
R39  2K2  [R_0603]
R40  100K  [R_0603]
R41  100K  [R_0603]
R42  2K2  [R_0603]
R43  4K7  [R_0603]
U6  NCP1117-3.3V  [TO-252]
U7  NCP1117-2.5V  [TO-252]
U8  NCP1117-5V  [TO-252]
X3  MPW-4R  [MPW-4R]

### Nets
+2.5V: C54.1 C55.1 U7.4(OUT)
+3.3V: C51.1 C52.1 U6.4(OUT)
+3z3: C49.1 DD7.1(CATHODE) R39.1 R42.2
+5V: C57.1 C58.1 L4.1 L5.1 U8.4(OUT)
CLink_VCC: C43.1 L5.2 R39.2
GND: C41.2 C42.2 C43.2 C44.2 C46.2 C47.1 C48.1 C49.2 C50.2 C51.2 C52.2 C53.2 C54.2 C55.2 C56.2 C57.2 C58.2 DD6.2(GND) DD7.3(ANODE) R41.2 R43.2 U6.1(GND) U7.1(GND) U8.1(GND) X3.2 X3.3 X3.4
Input_+5v: C44.1 C46.1 C50.1 C53.1 C56.1 DD6.1(EN) DD6.4(VIN) U6.3(IN) U7.3(IN) U8.3(IN) X3.1
USB_VCC: C41.1 C42.1 L4.2
VCC_FPGA_CORE: C45.2 C47.2 C48.2 L6.2 R40.2
NetC45_1: C45.1 DD6.5(FB) R40.1 R41.1
NetDD6_3: DD6.3(SW) L6.1
NetDD7_2: DD7.2(REF) R42.1 R43.1

### Notes on the sheet
- (near X3) Power Connector
- VCC_FPGA_CORE +1.2V
- USB Power
- C-Link Power
- (near U6) +3.3V
- (near U7) +2.5V
- +5V
- Перв. примен.
- Справ. №
- Подп. дата
- Инв. № дубл.
- Взам. инв. №
- Подп. и дата
- Изм.
- Разраб.
- Лист
- № докум.
- Подп.
- Дата
- Лит.
- Масса
- Масштаб
- Пров.
- Т.контр.
- Листов
- Инв. № подл.
- Н.контр.
- Утв.
- ALTIUM GOSTBOM2.0 KEV
- Файл:
- Копировал
- Формат А3

### Library data of the parts
C41-C50 C52 C53 C55 C56 C58 = C: Non-polarised capacitor; ComponentLink1Description: Manufacturer Link; ComponentLink1URL: www.murata.com; ComponentLink2Description: Datasheet Link; ComponentLink2URL: http://www.murata.com/products/catalog/pdf/c02e.pdf; ValueSCH: *
C51 C54 C57 = C_polar: Polarised capacitor; ComponentLink1Description: Manufacturer Link; ComponentLink1URL: www.murata.com; ComponentLink2Description: Datasheet Link; ComponentLink2URL: http://www.murata.com/products/catalog/pdf/c02e.pdf; ValueSCH: *
L4 L5 = L
L6 = L_2
R39-R43 = R
U6-U8 = NCP1117: 1.5 V,1.8 V, 1.9 V, 2.0 V, 2.5 V, 2.85 V, 3.3 V, 5.0 V,12 V
X3 = MPW-4R: Разъемы низковольтного питания

## Sheet Peripherals.SchDoc
size A4; SheetNumber: 7; SheetTotal: 7
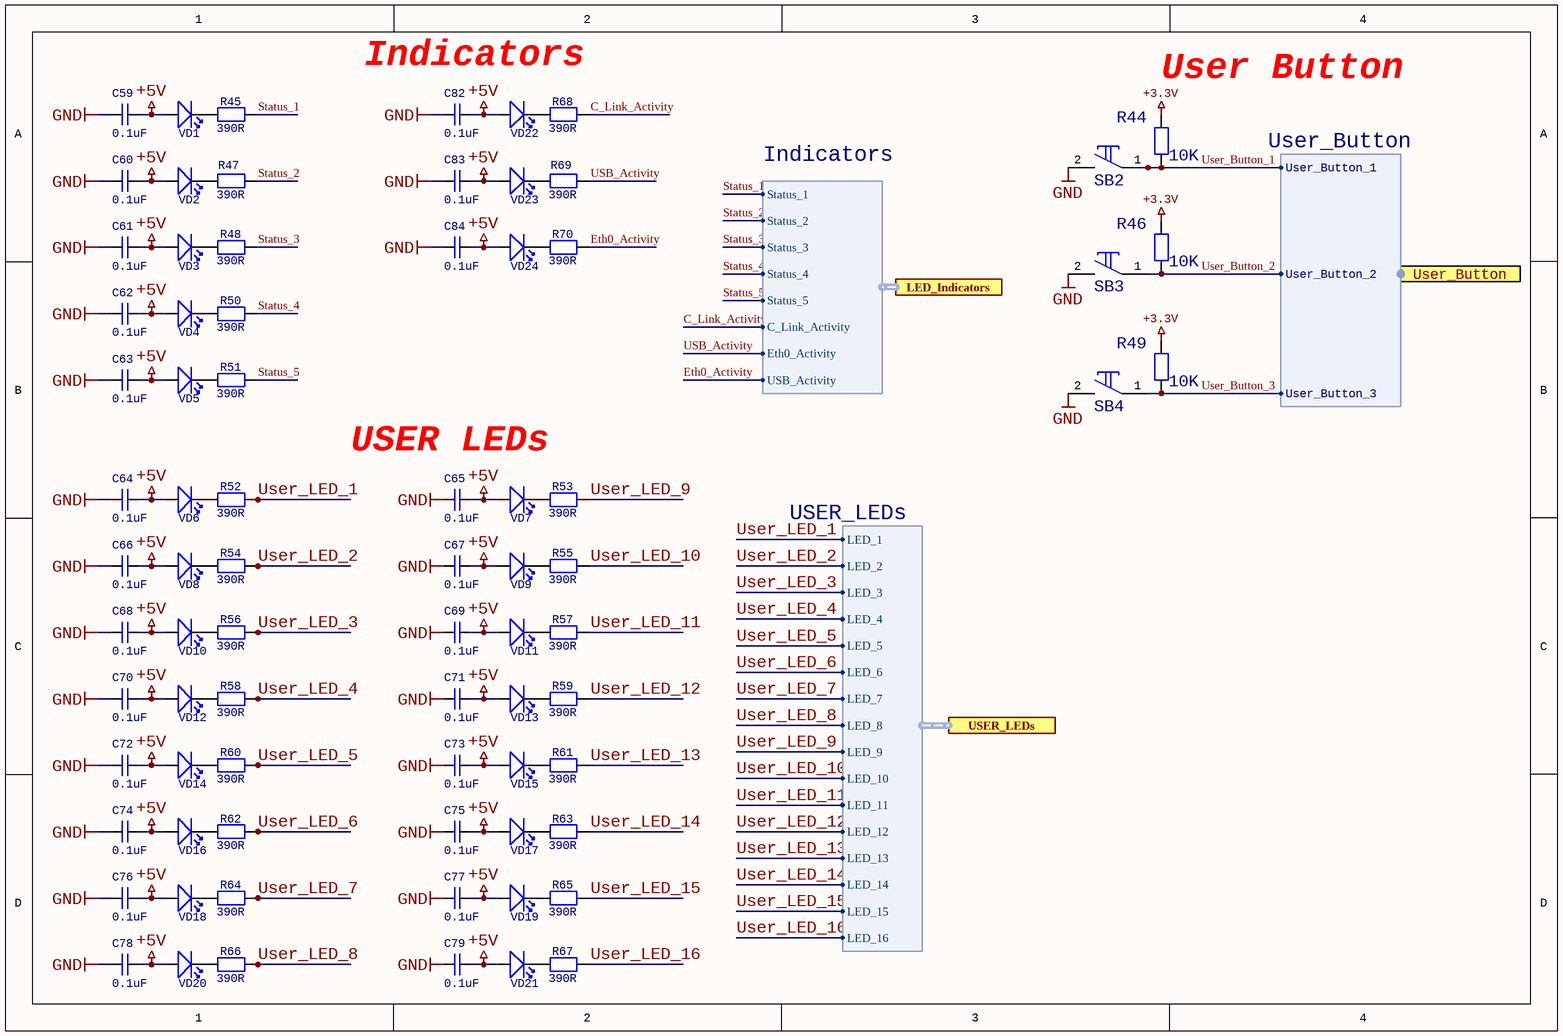
[diagram p7: Peripherals.SchDoc]

### Parts
C59  0.1uF  [C_0603]
C60  0.1uF  [C_0603]
C61  0.1uF  [C_0603]
C62  0.1uF  [C_0603]
C63  0.1uF  [C_0603]
C64  0.1uF  [C_0603]
C65  0.1uF  [C_0603]
C66  0.1uF  [C_0603]
C67  0.1uF  [C_0603]
C68  0.1uF  [C_0603]
C69  0.1uF  [C_0603]
C70  0.1uF  [C_0603]
C71  0.1uF  [C_0603]
C72  0.1uF  [C_0603]
C73  0.1uF  [C_0603]
C74  0.1uF  [C_0603]
C75  0.1uF  [C_0603]
C76  0.1uF  [C_0603]
C77  0.1uF  [C_0603]
C78  0.1uF  [C_0603]
C79  0.1uF  [C_0603]
C82  0.1uF  [C_0603]
C83  0.1uF  [C_0603]
C84  0.1uF  [C_0603]
R44  10K  [R_0805]
R45  390R  [R_0603]
R46  10K  [R_0805]
R47  390R  [R_0603]
R48  390R  [R_0603]
R49  10K  [R_0805]
R50  390R  [R_0603]
R51  390R  [R_0603]
R52  390R  [R_0603]
R53  390R  [R_0603]
R54  390R  [R_0603]
R55  390R  [R_0603]
R56  390R  [R_0603]
R57  390R  [R_0603]
R58  390R  [R_0603]
R59  390R  [R_0603]
R60  390R  [R_0603]
R61  390R  [R_0603]
R62  390R  [R_0603]
R63  390R  [R_0603]
R64  390R  [R_0603]
R65  390R  [R_0603]
R66  390R  [R_0603]
R67  390R  [R_0603]
R68  390R  [R_0603]
R69  390R  [R_0603]
R70  390R  [R_0603]
SB2  Text  [DTS-32]  (value not drawn)
SB3  Text  [DTS-32]  (value not drawn)
SB4  Text  [DTS-32]  (value not drawn)
VD1  LED  [LD0805]  (value not drawn)
VD2  LED  [LD0805]  (value not drawn)
VD3  LED  [LD0805]  (value not drawn)
VD4  LED  [LD0805]  (value not drawn)
VD5  LED  [LD0805]  (value not drawn)
VD6  LED  [LD0805]  (value not drawn)
VD7  LED  [LD0805]  (value not drawn)
VD8  LED  [LD0805]  (value not drawn)
VD9  LED  [LD0805]  (value not drawn)
VD10  LED  [LD0805]  (value not drawn)
VD11  LED  [LD0805]  (value not drawn)
VD12  LED  [LD0805]  (value not drawn)
VD13  LED  [LD0805]  (value not drawn)
VD14  LED  [LD0805]  (value not drawn)
VD15  LED  [LD0805]  (value not drawn)
VD16  LED  [LD0805]  (value not drawn)
VD17  LED  [LD0805]  (value not drawn)
VD18  LED  [LD0805]  (value not drawn)
VD19  LED  [LD0805]  (value not drawn)
VD20  LED  [LD0805]  (value not drawn)
VD21  LED  [LD0805]  (value not drawn)
VD22  LED  [LD0805]  (value not drawn)
VD23  LED  [LD0805]  (value not drawn)
VD24  LED  [LD0805]  (value not drawn)

### Ports
LED_Indicators (harness Indicators), User_Button (harness User_Button), USER_LEDs (harness USER_LEDs)

### Harnesses
USER_LEDs: LED_1, LED_2, LED_3, LED_4, LED_5, LED_6, LED_7, LED_8, LED_9, LED_10, LED_11, LED_12, LED_13, LED_14, LED_15, LED_16
User_Button: User_Button_1, User_Button_2, User_Button_3
Indicators: Eth0_Activity, USB_Activity, C_Link_Activity, Status_5, Status_4, Status_3, Status_2, Status_1

### Nets
+3.3V: R44.1 R46.1 R49.1
+5V: C59.2 C60.2 C61.2 C62.2 C63.2 C64.2 C65.2 C66.2 C67.2 C68.2 C69.2 C70.2 C71.2 C72.2 C73.2 C74.2 C75.2 C76.2 C77.2 C78.2 C79.2 C82.2 C83.2 C84.2 VD1.1(+) VD2.1(+) VD3.1(+) VD4.1(+) VD5.1(+) VD6.1(+) VD7.1(+) VD8.1(+) VD9.1(+) VD10.1(+) VD11.1(+) VD12.1(+) VD13.1(+) VD14.1(+) VD15.1(+) VD16.1(+) VD17.1(+) VD18.1(+) VD19.1(+) VD20.1(+) VD21.1(+) VD22.1(+) VD23.1(+) VD24.1(+)
GND: C59.1 C60.1 C61.1 C62.1 C63.1 C64.1 C65.1 C66.1 C67.1 C68.1 C69.1 C70.1 C71.1 C72.1 C73.1 C74.1 C75.1 C76.1 C77.1 C78.1 C79.1 C82.1 C83.1 C84.1 SB2.2 SB3.2 SB4.2
C_Link_Activity: R68.2 ; port LED_Indicators.C_Link_Activity
Eth0_Activity: R70.2 ; port LED_Indicators.USB_Activity
Status_1: R45.2 ; port LED_Indicators.Status_1
Status_2: R47.2 ; port LED_Indicators.Status_2
Status_3: R48.2 ; port LED_Indicators.Status_3
Status_4: R50.2 ; port LED_Indicators.Status_4
Status_5: R51.2 ; port LED_Indicators.Status_5
USB_Activity: R69.2 ; port LED_Indicators.Eth0_Activity
User_Button_1: R44.2 SB2.1 ; port User_Button.User_Button_1
User_Button_2: R46.2 SB3.1 ; port User_Button.User_Button_2
User_Button_3: R49.2 SB4.1 ; port User_Button.User_Button_3
User_LED_1: R52.2 ; port USER_LEDs.LED_1
User_LED_2: R54.2 ; port USER_LEDs.LED_2
User_LED_3: R56.2 ; port USER_LEDs.LED_3
User_LED_4: R58.2 ; port USER_LEDs.LED_4
User_LED_5: R60.2 ; port USER_LEDs.LED_5
User_LED_6: R62.2 ; port USER_LEDs.LED_6
User_LED_7: R64.2 ; port USER_LEDs.LED_7
User_LED_8: R66.2 ; port USER_LEDs.LED_8
User_LED_9: R53.2 ; port USER_LEDs.LED_9
User_LED_10: R55.2 ; port USER_LEDs.LED_10
User_LED_11: R57.2 ; port USER_LEDs.LED_11
User_LED_12: R59.2 ; port USER_LEDs.LED_12
User_LED_13: R61.2 ; port USER_LEDs.LED_13
User_LED_14: R63.2 ; port USER_LEDs.LED_14
User_LED_15: R65.2 ; port USER_LEDs.LED_15
User_LED_16: R67.2 ; port USER_LEDs.LED_16
NetR45_1: R45.1 VD1.2(-)
NetR47_1: R47.1 VD2.2(-)
NetR48_1: R48.1 VD3.2(-)
NetR50_1: R50.1 VD4.2(-)
NetR51_1: R51.1 VD5.2(-)
NetR52_1: R52.1 VD6.2(-)
NetR53_1: R53.1 VD7.2(-)
NetR54_1: R54.1 VD8.2(-)
NetR55_1: R55.1 VD9.2(-)
NetR56_1: R56.1 VD10.2(-)
NetR57_1: R57.1 VD11.2(-)
NetR58_1: R58.1 VD12.2(-)
NetR59_1: R59.1 VD13.2(-)
NetR60_1: R60.1 VD14.2(-)
NetR61_1: R61.1 VD15.2(-)
NetR62_1: R62.1 VD16.2(-)
NetR63_1: R63.1 VD17.2(-)
NetR64_1: R64.1 VD18.2(-)
NetR65_1: R65.1 VD19.2(-)
NetR66_1: R66.1 VD20.2(-)
NetR67_1: R67.1 VD21.2(-)
NetR68_1: R68.1 VD22.2(-)
NetR69_1: R69.1 VD23.2(-)
NetR70_1: R70.1 VD24.2(-)

### Notes on the sheet
- Indicators
- (near R44) User Button
- USER LEDs

### Library data of the parts
C59-C79 C82-C84 = C: Non-polarised capacitor; ComponentLink1Description: Manufacturer Link; ComponentLink1URL: www.murata.com; ComponentLink2Description: Datasheet Link; ComponentLink2URL: http://www.murata.com/products/catalog/pdf/c02e.pdf; ValueSCH: *
R44-R70 = R
SB2-SB4 = Button: Published: 17.04.2014; Publisher: Andrew Danich; Type: Переключатель

## Nets that join several sheets
+3.3V: FPGA (46 pins), Ethernet (17 pins), USB (C80.1 U4.4), Power (C51.1 C52.1 U6.4), Peripherals (R44.1 R46.1 R49.1)
+3z3: C-Link (DD1.5 DD3.5), Power (C49.1 DD7.1 R39.1 R42.2)
+5V: Power (5 pins), Peripherals (48 pins)
CLink_VCC: C-Link (6 pins), Power (C43.1 L5.2 R39.2)
GND: C-Link (12 pins), FPGA (48 pins), Ethernet (33 pins), USB (14 pins), Power (27 pins), Peripherals (27 pins)
Quartz_25MHz: FPGA (U1.3 U2.131), Ethernet (R28.1 U5.1)
USB_VCC: USB (C30.1 U4.20), Power (C41.1 C42.1 L4.2)
VCC_FPGA_CORE: FPGA (24 pins), Power (5 pins)
C_Link_Activity: FPGA (U2.139), Peripherals (R68.2)
C_LINK_TX/RX: C-Link (DD2.3 DD2.4), FPGA (U2.135)
COL: FPGA (U2.60), Ethernet (U5.62)
CRS: FPGA (U2.59), Ethernet (U5.63)
Eth0_Activity: FPGA (U2.137), Peripherals (R70.2)
MDC: FPGA (U2.84), Ethernet (U5.43)
MDDIS: FPGA (U2.56), Ethernet (U5.3)
MDINT: FPGA (U2.58), Ethernet (U5.64)
MDIO: FPGA (U2.86), Ethernet (U5.42)
NetDD2_1: C-Link (DD2.1), FPGA (R3.1)
NetDD4_1: C-Link (DD4.1), FPGA (R1.1)
RX_CLK: FPGA (U2.72), Ethernet (U5.52)
RX_D0: FPGA (U2.77), Ethernet (U5.48)
RX_D1: FPGA (U2.81), Ethernet (U5.47)
RX_D2: FPGA (U2.82), Ethernet (U5.46)
RX_D3: FPGA (U2.83), Ethernet (U5.45)
RX_DV: FPGA (U2.76), Ethernet (U5.49)
RX_ER: FPGA (U2.71), Ethernet (U5.53)
Status_1: FPGA (U2.20), Peripherals (R45.2)
Status_2: FPGA (U2.19), Peripherals (R47.2)
Status_3: FPGA (U2.18), Peripherals (R48.2)
Status_4: FPGA (U2.17), Peripherals (R50.2)
Status_5: FPGA (U2.16), Peripherals (R51.2)
TX_CLK: FPGA (U2.69), Ethernet (U5.55)
TX_D0: FPGA (U2.67), Ethernet (U5.57)
TX_D1: FPGA (U2.66), Ethernet (U5.58)
TX_D2: FPGA (U2.65), Ethernet (U5.59)
TX_D3: FPGA (U2.61), Ethernet (U5.60)
TX_EN: FPGA (U2.68), Ethernet (U5.56)
TX_ER: FPGA (U2.70), Ethernet (U5.54)
USB_Activity: FPGA (U2.136), Peripherals (R69.2)
USB_D0: FPGA (U2.53), USB (U4.1)
USB_D1: FPGA (U2.46), USB (U4.5)
USB_D2: FPGA (U2.47), USB (U4.3)
USB_D3: FPGA (U2.41), USB (U4.11)
USB_D4: FPGA (U2.48), USB (U4.2)
USB_D5: FPGA (U2.43), USB (U4.9)
USB_D6: FPGA (U2.42), USB (U4.10)
USB_D7: FPGA (U2.45), USB (U4.6)
USB_PWREN: FPGA (U2.40), USB (U4.12)
USB_RD: FPGA (U2.39), USB (U4.13)
USB_RFX: FPGA (U2.55), USB (U4.23)
USB_TXE: FPGA (U2.54), USB (U4.22)
USB_WR: FPGA (U2.38), USB (U4.14)
User_Button_1: FPGA (U2.105), Peripherals (R44.2 SB2.1)
User_Button_2: FPGA (U2.106), Peripherals (R46.2 SB3.1)
User_Button_3: FPGA (U2.109), Peripherals (R49.2 SB4.1)
User_LED_1: FPGA (U2.144), Peripherals (R52.2)
User_LED_2: FPGA (U2.142), Peripherals (R54.2)
User_LED_3: FPGA (U2.141), Peripherals (R56.2)
User_LED_4: FPGA (U2.140), Peripherals (R58.2)
User_LED_5: FPGA (U2.124), Peripherals (R60.2)
User_LED_6: FPGA (U2.123), Peripherals (R62.2)
User_LED_7: FPGA (U2.119), Peripherals (R64.2)
User_LED_8: FPGA (U2.118), Peripherals (R66.2)
User_LED_9: FPGA (U2.117), Peripherals (R53.2)
User_LED_10: FPGA (U2.116), Peripherals (R55.2)
User_LED_11: FPGA (U2.115), Peripherals (R57.2)
User_LED_12: FPGA (U2.114), Peripherals (R59.2)
User_LED_13: FPGA (U2.113), Peripherals (R61.2)
User_LED_14: FPGA (U2.112), Peripherals (R63.2)
User_LED_15: FPGA (U2.111), Peripherals (R65.2)
User_LED_16: FPGA (U2.110), Peripherals (R67.2)